# Altium schematic sheet LegControleur.SchDoc
size A4
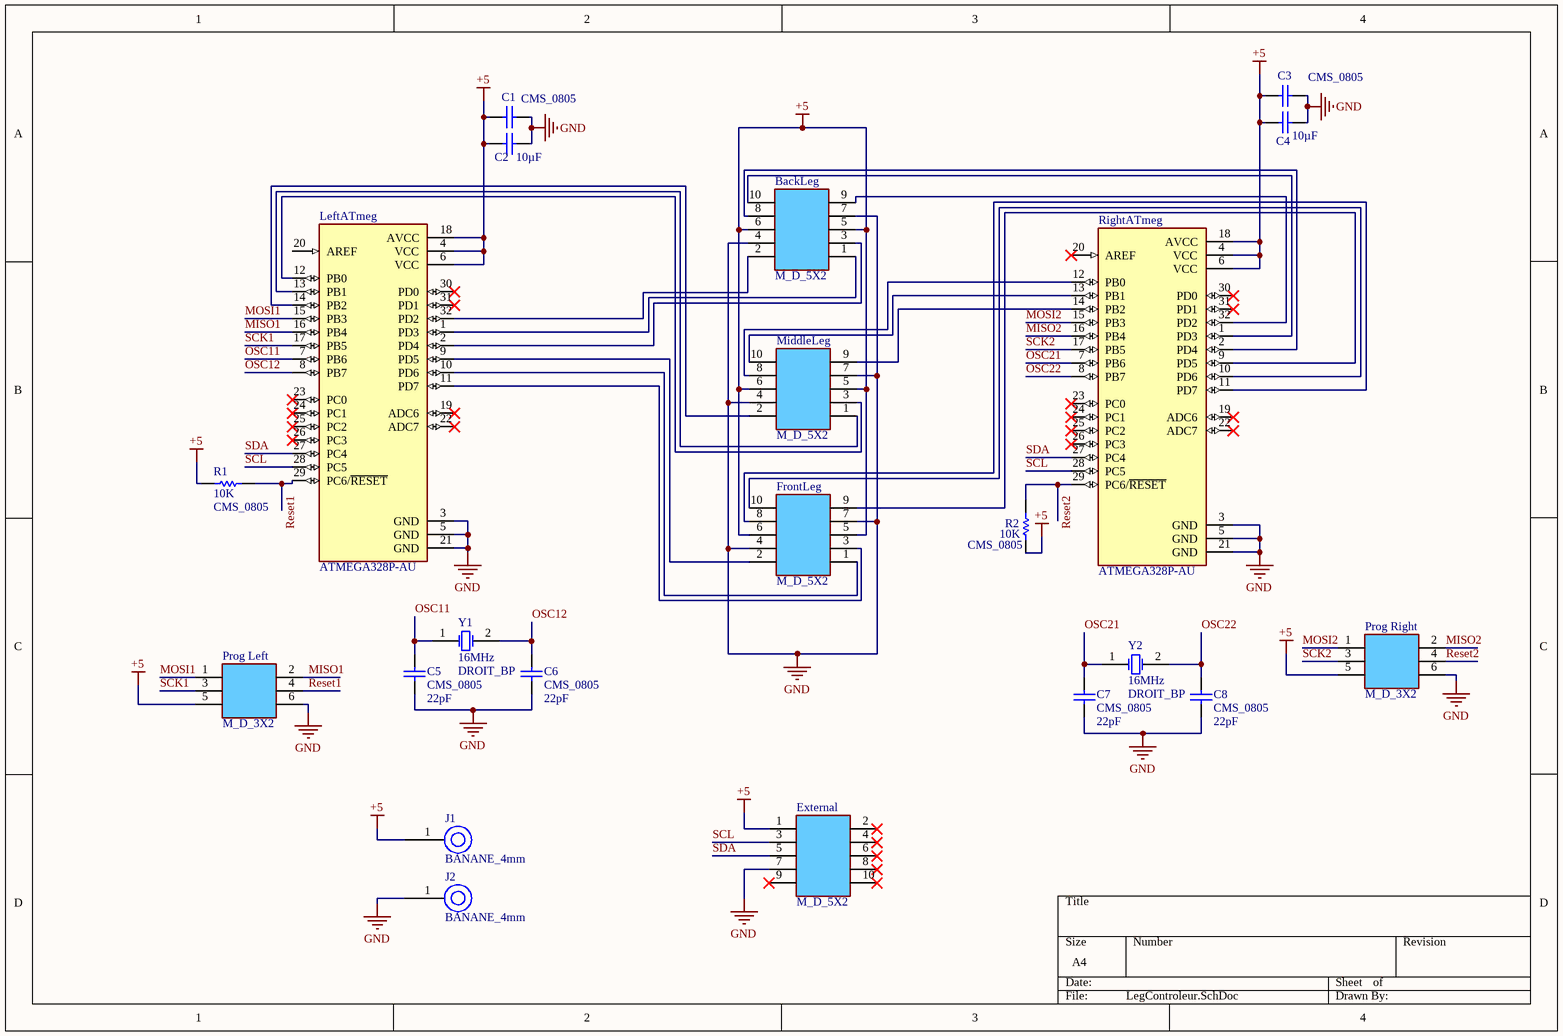
[diagram p0: LegControleur.SchDoc]

## Parts
BackLeg  Type: M_D_5X2  [BARRETTE_5X2_M_D]  (hidden comment: BARRETTE_5 CONTACTS_2 RANGEES_MALE_DROITE)
C1  value 10µF  Type: CMS_0805  [CONDENSATEUR_CMS_0805]  (hidden comment: CMS_0805_AVCC)
C2  CMS_0805_VCC  [CONDENSATEUR_CMS_0805]  (value not drawn)
C3  value 10µF  Type: CMS_0805  [CONDENSATEUR_CMS_0805]  (hidden comment: CMS_0805_AVCC)
C4  CMS_0805_VCC  [CONDENSATEUR_CMS_0805]  (value not drawn)
C5  value 22pF  [CONDENSATEUR_CMS_0805]  (hidden comment: CMS_0805)
C6  value 22pF  [CONDENSATEUR_CMS_0805]  (hidden comment: CMS_0805)
C7  value 22pF  [CONDENSATEUR_CMS_0805]  (hidden comment: CMS_0805)
C8  value 22pF  [CONDENSATEUR_CMS_0805]  (hidden comment: CMS_0805)
External  Type: M_D_5X2  [BARRETTE_5X2_M_D]  (hidden comment: BARRETTE_5 CONTACTS_2 RANGEES_MALE_DROITE)
FrontLeg  Type: M_D_5X2  [BARRETTE_5X2_M_D]  (hidden comment: BARRETTE_5 CONTACTS_2 RANGEES_MALE_DROITE)
J1  Type: BANANE_4mm  [DOUILLE_BANANE_4mm]  (hidden comment: Alim 5v)
J2  Type: BANANE_4mm  [DOUILLE_BANANE_4mm]  (hidden comment: Alim GND)
LeftATmeg  ATMEGA328P-AU  [QFP80P900X900X120-32N]
MiddleLeg  Type: M_D_5X2  [BARRETTE_5X2_M_D]  (hidden comment: BARRETTE_5 CONTACTS_2 RANGEES_MALE_DROITE)
Prog_Left  Type: M_D_3X2  [BARRETTE_3X2_M_D]  (hidden comment: BARRETTE_3 CONTACTS_2 RANGEES_MALE_DROITE)
Prog_Right  Type: M_D_3X2  [BARRETTE_3X2_M_D]  (hidden comment: BARRETTE_3 CONTACTS_2 RANGEES_MALE_DROITE)
R1  value 10K  Type: CMS_0805  [RESISTANCE_CMS_0805]  (hidden comment: RESISTANCE_CMS_0805)
R2  value 10K  Type: CMS_0805  [RESISTANCE_CMS_0805]  (hidden comment: RESISTANCE_CMS_0805)
RightATmeg  ATMEGA328P-AU  [QFP80P900X900X120-32N]
Y1  value 16MHz  Type: DROIT_BP  [QUARTZ_DROIT_BP]  (hidden comment: QUARTZ_DROIT_BAS_PROFIL)
Y2  value 16MHz  Type: DROIT_BP  [QUARTZ_DROIT_BP]  (hidden comment: QUARTZ_DROIT_BAS_PROFIL)

## Nets
+5: BackLeg.5 BackLeg.6 C1.2 C2.2 C3.2 C4.2 External.1 FrontLeg.5 FrontLeg.6 J1.1 LeftATmeg.4(VCC) LeftATmeg.6(VCC) LeftATmeg.18(AVCC) MiddleLeg.5 MiddleLeg.6 Prog_Left.5 Prog_Right.5 R1.1 R2.1 RightATmeg.4(VCC) RightATmeg.6(VCC) RightATmeg.18(AVCC)
GND: BackLeg.4 BackLeg.7 C1.1 C2.1 C3.1 C4.1 C5.1 C6.1 C7.1 C8.1 External.7 FrontLeg.4 FrontLeg.7 J2.1 LeftATmeg.3(GND) LeftATmeg.5(GND) LeftATmeg.21(GND) MiddleLeg.4 MiddleLeg.7 Prog_Left.6 Prog_Right.6 RightATmeg.3(GND) RightATmeg.5(GND) RightATmeg.21(GND)
MISO1: LeftATmeg.16(PB4) Prog_Left.2
MISO2: Prog_Right.2 RightATmeg.16(PB4)
MOSI1: LeftATmeg.15(PB3) Prog_Left.1
MOSI2: Prog_Right.1 RightATmeg.15(PB3)
OSC11: C5.2 LeftATmeg.7(PB6) Y1.1(OSC1)
OSC12: C6.2 LeftATmeg.8(PB7) Y1.2(OSC2)
OSC21: C7.2 RightATmeg.7(PB6) Y2.1(OSC1)
OSC22: C8.2 RightATmeg.8(PB7) Y2.2(OSC2)
Reset1: LeftATmeg.29(PC6/~{RESET}) Prog_Left.4 R1.2
Reset2: Prog_Right.4 R2.2 RightATmeg.29(PC6/~{RESET})
SCK1: LeftATmeg.17(PB5) Prog_Left.3
SCK2: Prog_Right.3 RightATmeg.17(PB5)
SCL: External.3 LeftATmeg.28(PC5) RightATmeg.28(PC5)
SDA: External.5 LeftATmeg.27(PC4) RightATmeg.27(PC4)
NetBackLeg_1: BackLeg.1 LeftATmeg.1(PD3)
NetBackLeg_2: BackLeg.2 LeftATmeg.32(PD2)
NetBackLeg_3: BackLeg.3 LeftATmeg.2(PD4)
NetBackLeg_8: BackLeg.8 RightATmeg.2(PD4)
NetBackLeg_9: BackLeg.9 RightATmeg.32(PD2)
NetBackLeg_10: BackLeg.10 RightATmeg.1(PD3)
NetFrontLeg_1: FrontLeg.1 LeftATmeg.10(PD6)
NetFrontLeg_2: FrontLeg.2 LeftATmeg.9(PD5)
NetFrontLeg_3: FrontLeg.3 LeftATmeg.11(PD7)
NetFrontLeg_8: FrontLeg.8 RightATmeg.11(PD7)
NetFrontLeg_9: FrontLeg.9 RightATmeg.9(PD5)
NetFrontLeg_10: FrontLeg.10 RightATmeg.10(PD6)
NetLeftATmeg_12: LeftATmeg.12(PB0) MiddleLeg.3
NetLeftATmeg_13: LeftATmeg.13(PB1) MiddleLeg.1
NetLeftATmeg_14: LeftATmeg.14(PB2) MiddleLeg.2
NetMiddleLeg_8: MiddleLeg.8 RightATmeg.12(PB0)
NetMiddleLeg_9: MiddleLeg.9 RightATmeg.14(PB2)
NetMiddleLeg_10: MiddleLeg.10 RightATmeg.13(PB1)

Not connected (* = marked no-connect by the designer): External 2* 4* 6* 8* 9* 10*; LeftATmeg 19(ADC6)* 20(AREF) 22(ADC7)* 23(PC0)* 24(PC1)* 25(PC2)* 26(PC3)* 30(PD0)* 31(PD1)*; RightATmeg 19(ADC6)* 20(AREF)* 22(ADC7)* 23(PC0)* 24(PC1)* 25(PC2)* 26(PC3)* 30(PD0)* 31(PD1)*

## Library data of the parts
BackLeg External FrontLeg MiddleLeg = BARRETTE_5 CONTACTS_2 RANGEES_MALE_DROITE: BARRETTE 5 CONTACTS 2 RANGEES MALE DROITE
C1 C3 C5-C8 = CONDENSATEUR_CMS_CER_0805: CONDENSATEUR CMS CERAMIQUE 0805
  C5-C8: Type: CMS_0805
C2 C4 = CONDENSATEUR_CMS_CER_0805: CONDENSATEUR CMS CERAMIQUE 0805; Value: 10µF; Type: CMS_0805
J1 J2 = DOUILLE_BANANE_4mm: DOUILLE BANANE 4 mm
LeftATmeg RightATmeg = ATMEGA328P-AU: AVR AVRÂ® ATmega Microcontroller IC 8-Bit 20MHz 32KB (16K x 16) FLASH 32-TQFP (7x7); MF: Microchip Technology; Value: *; SnapEDA_Link: https://www.snapeda.com/parts/ATMEGA328P-AU/Microchip/view-part/?ref=snap; MP: ATMEGA328P-AU; Purchase-URL: https://pricing.snapeda.com/search/part/ATMEGA328P-AU/?ref=eda; Check_prices: https://www.snapeda.com/parts/ATMEGA328P-AU/Microchip/view-part/?ref=eda; Availability: In Stock; Price: None; Package: TQFP-32 Microchip
Prog_Left Prog_Right = BARRETTE_3 CONTACTS_2 RANGEES_MALE_DROITE: BARRETTE 3 CONTACTS 2 RANGEES MALE DROITE
R1 R2 = RESISTANCE_CMS_0805: RESISTANCE CMS 0805
Y1 Y2 = QUARTZ_DROIT_BAS_PROFIL: QUARTZ DROIT BAS PROFIL